# Altium project Glove_V2.PrjPCB
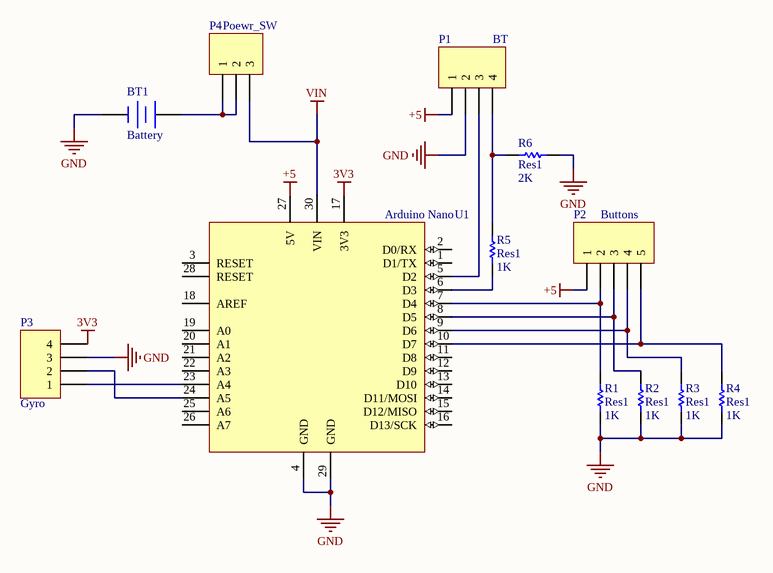
[diagram p0: Glove_V2.SchDoc]
1 sheet, 12 parts. Net scope: global (net labels, ports and power ports of the same name join across sheets).
Board file: Glove_V2.PcbDoc

## Sheet Glove_V2.SchDoc
size A4

### Parts
BT1  Battery  [BAT-2]
P1  BT  [HDR1X4H]
P2  Buttons  [HDR1X5H]
P3  Gyro  [HDR1X4H]
P4  Poewr_SW  [HDR1X3]
R1  Res1  value 1K  [AXIAL-0.3]
R2  Res1  value 1K  [AXIAL-0.3]
R3  Res1  value 1K  [AXIAL-0.3]
R4  Res1  value 1K  [AXIAL-0.3]
R5  Res1  value 1K  [AXIAL-0.3]
R6  Res1  value 2K  [AXIAL-0.3]
U1  Arduino Nano  [Arduino_Nano]

### Nets
3V3: P3.4 U1.17(3V3)
+5: P1.1 P2.1 U1.27(5V)
GND: BT1.2(-) P1.2 P3.3 R1.1 R2.1 R3.1 R4.1 R6.1 U1.4(GND) U1.29(GND)
VIN: P4.3 U1.30(VIN)
NetBT1_1: BT1.1(+) P4.1 P4.2
NetP1_3: P1.3 U1.5(D2)
NetP1_4: P1.4 R5.2 R6.2
NetP2_2: P2.2 R1.2 U1.7(D4)
NetP2_3: P2.3 R2.2 U1.8(D5)
NetP2_4: P2.4 R3.2 U1.9(D6)
NetP2_5: P2.5 R4.2 U1.10(D7)
NetP3_1: P3.1 U1.23(A4)
NetP3_2: P3.2 U1.24(A5)
NetR5_1: R5.1 U1.6(D3)

Not connected (* = marked no-connect by the designer): U1 1(D1/TX) 2(D0/RX) 3(RESET) 11(D8) 12(D9) 13(D10) 14(D11/MOSI) 15(D12/MISO) 16(D13/SCK) 18(AREF) 19(A0) 20(A1) 21(A2) 22(A3) 25(A6) 26(A7) 28(RESET)

### Library data of the parts
BT1 = Battery: Multicell Battery; Published: 24-Mar-1999; LatestRevisionDate: 17-Jul-2002; LatestRevisionNote: Re-released for DXP Platform.; PackageReference: BAT-2; Publisher: Altium Limited; PackageDescription: Battery; 2 Leads
P1 P3 = Header 4H: Header, 4-Pin, Right Angle; LatestRevisionDate: 17-Jul-2002; LatestRevisionNote: Re-released for DXP Platform.; Publisher: Altium Limited
P2 = Header 5H: Header, 5-Pin, Right Angle; LatestRevisionDate: 17-Jul-2002; LatestRevisionNote: Re-released for DXP Platform.; Publisher: Altium Limited
P4 = Header 3: Header, 3-Pin; LatestRevisionDate: 17-Jul-2002; LatestRevisionNote: Re-released for DXP Platform.; Publisher: Altium Limited
R1-R6 = Res1: Resistor; Published: 8-Jun-2000; LatestRevisionDate: 17-Jul-2002; LatestRevisionNote: Re-released for DXP Platform.; PackageReference: AXIAL-0.3; Publisher: Altium Limited; PackageDescription: Axial Device, Thru-Hole; 2 Leads; 0.3 in Pin Spacing